# EAGLE design RedFly-Shield_v11 (EAGLE 6.5.0)
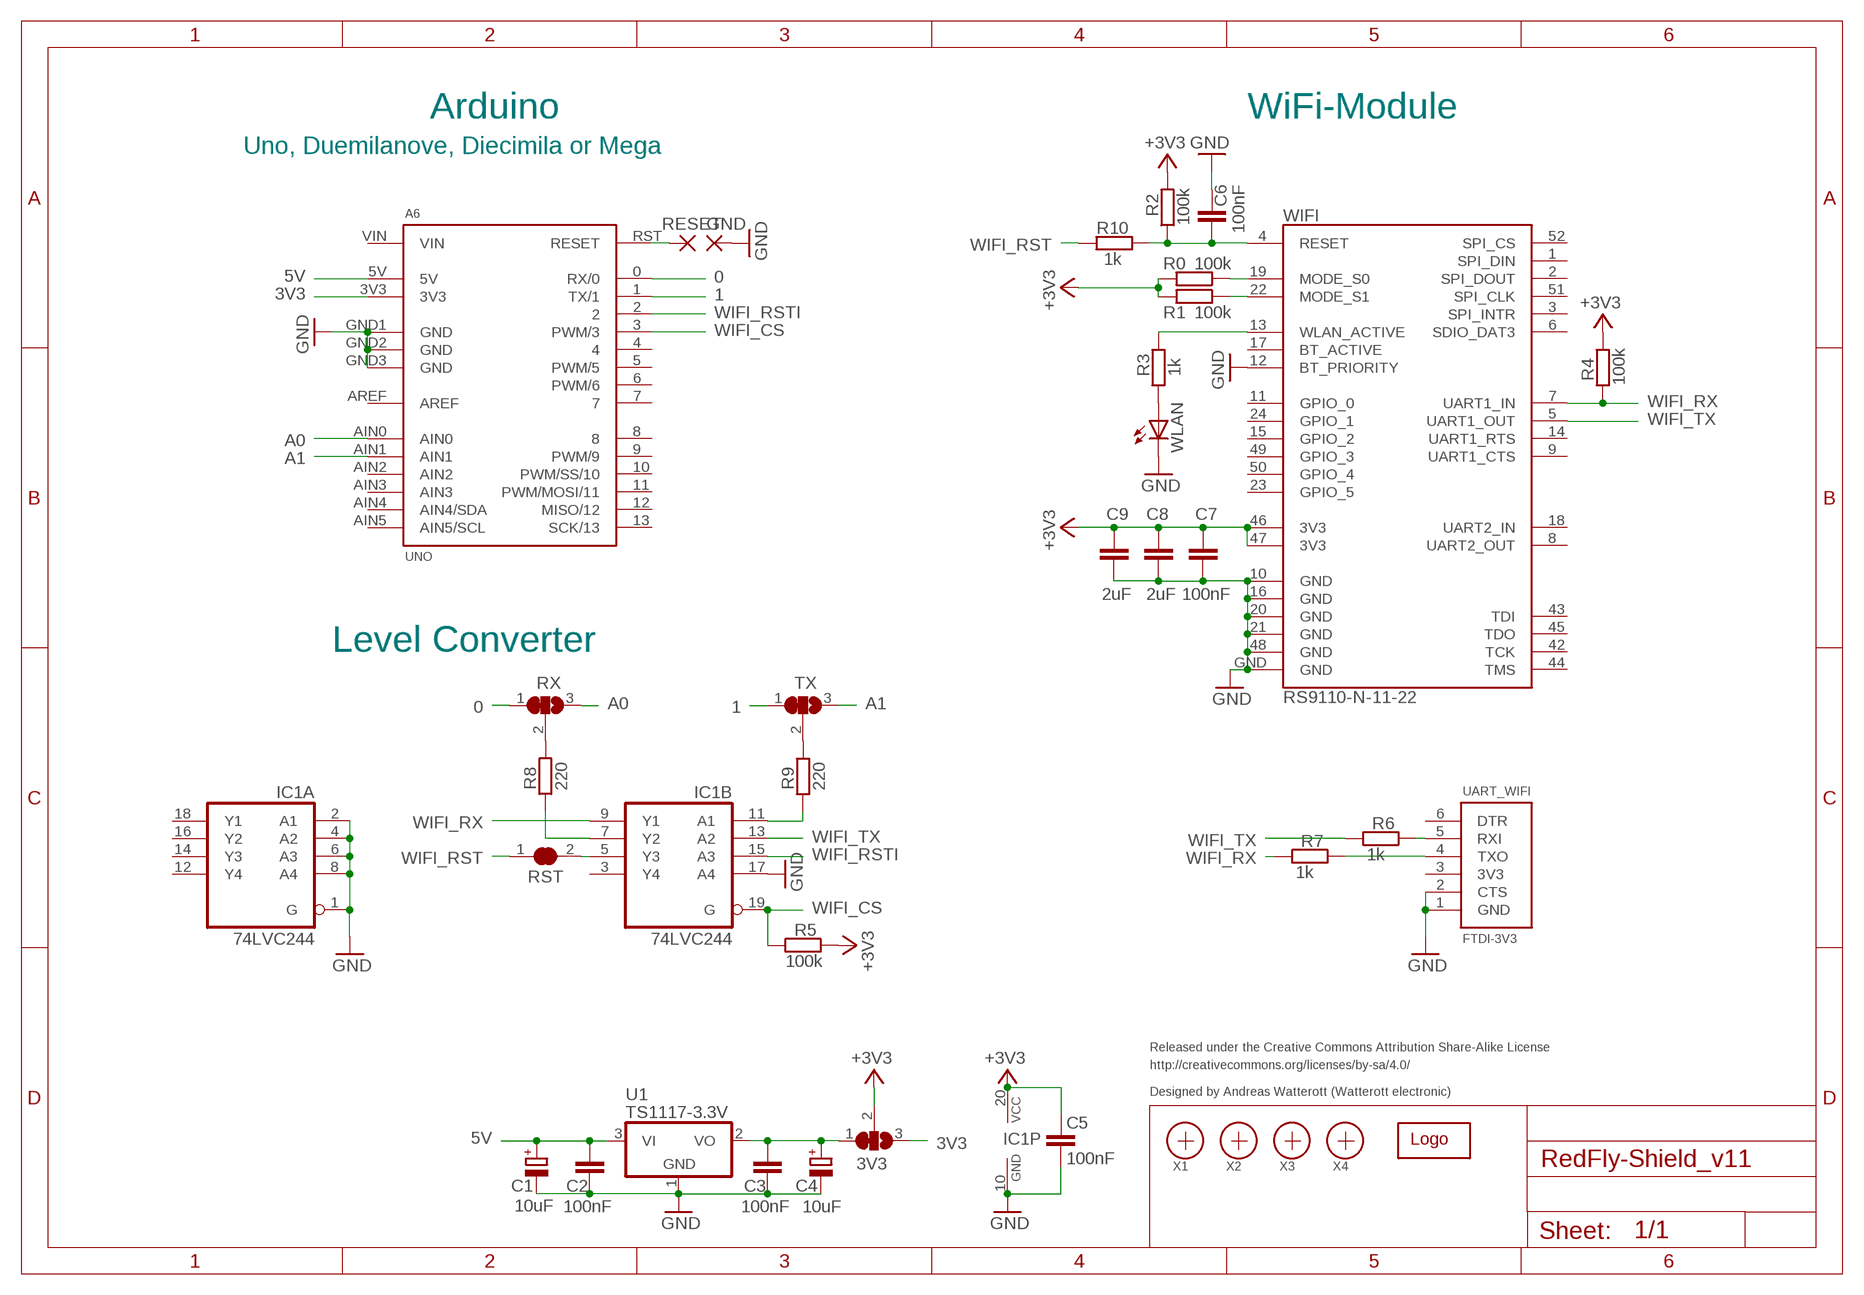
[diagram p0: schematic, sheet 1]

## Parts
3V3  SJ2W  [SJ_2]
A6  UNO  DUEMILANOVE  [DUEMILANOVE]
C1  10uF  CPOL-EU153CLV-0505  [153CLV-0505]
C2  100nF  C-EUC0603  [C0603]
C3  100nF  C-EUC0603  [C0603]
C4  10uF  CPOL-EU153CLV-0505  [153CLV-0505]
C5  100nF  C-EUC0603  [C0603]
C6  100nF  C-EUC0603  [C0603]
C7  100nF  C-EUC0603  [C0603]
C8  2uF  C-EUC0603  [C0603]
C9  2uF  C-EUC0603  [C0603]
GND  SMD2  [SMD1,27-2,54]
IC1  74LVC244  74HC244DW  [SO20W]
R0  100k  R-EU_R0603  [R0603]
R1  100k  R-EU_R0603  [R0603]
R2  100k  R-EU_R0603  [R0603]
R3  1k  R-EU_R0603  [R0603]
R4  100k  R-EU_R0603  [R0603]
R5  100k  R-EU_R0603  [R0603]
R6  1k  R-EU_R0603  [R0603]
R7  1k  R-EU_R0603  [R0603]
R8  220  R-EU_R0603  [R0603]
R9  220  R-EU_R0603  [R0603]
R10  1k  R-EU_R0603  [R0603]
RESET  SMD2  [SMD1,27-2,54]
RST  SJ  [SJ]
RX  SJ2W  [SJ_2]
TX  SJ2W  [SJ_2]
U1  TS1117-3.3V  TS1117  [SOT223]
U$1  WE-LOGO  [WE-LOGO]
UART_WIFI  FTDI-3V3  FTDI  [FTDI]
WIFI  RS9110-N-11-22  RS9110-N-11-21  [RS9110-N-11-21]
WLAN  LEDCHIPLED_0805  [CHIPLED_0805]
X1  PASSER  [PASSER]
X2  PASSER  [PASSER]
X3  PASSER  [PASSER]
X4  PASSER  [PASSER]

## Nets
0: A6.0(RX/0) RX.1
1: A6.1(TX/1) TX.1
3V3: 3V3.3 A6.3V3
3V_OUT: 3V3.1 C3.1 C4.+ U1.2(VO)
5V: A6.5V C1.+ C2.1 U1.3(VI)
+3V3: 3V3.2 C5.1 C7.1 C8.1 C9.1 IC1.20(P:VCC) R0.2 R1.2 R2.2 R4.1 R5.2 WIFI.46(3V3) WIFI.47(3V3)
A0: A6.AIN0 RX.3
A1: A6.AIN1 TX.3
GND: A6.GND1(GND) A6.GND2(GND) A6.GND3(GND) C1.- C2.2 C3.2 C4.- C5.2 C6.1 C7.2 C8.2 C9.2 GND.1(P) IC1.1(A:G) IC1.2(A:A1) IC1.4(A:A2) IC1.6(A:A3) IC1.8(A:A4) IC1.10(P:GND) IC1.17(B:A4) U1.1(GND) UART_WIFI.1(GND) UART_WIFI.2(CTS) WIFI.10(GND) WIFI.12(BT_PRIORITY) WIFI.16(GND) WIFI.20(GND) WIFI.21(GND) WIFI.48(GND) WIFI.GND WLAN.C
N$1: R0.1 WIFI.19(MODE_S0)
N$6: R1.1 WIFI.22(MODE_S1)
N$11: R3.1 WIFI.13(WLAN_ACTIVE)
N$12: R3.2 WLAN.A
N$103: R6.1 UART_WIFI.5(RXI)
N$104: R7.1 UART_WIFI.4(TXO)
RST: A6.RST(RESET) RESET.1(P)
WIFI_CS: A6.3(PWM/3) IC1.19(B:G) R5.1
WIFI_RST: R10.2 RST.1
WIFI_RST2: C6.2 R2.1 R10.1 WIFI.4(RESET)
WIFI_RSTI: A6.2 IC1.15(B:A3)
WIFI_RSTO: IC1.5(B:Y3) RST.2
WIFI_RX: IC1.9(B:Y1) R4.2 R7.2 WIFI.7(UART1_IN)
WIFI_RX2: R9.1 TX.2
WIFI_RXI: IC1.11(B:A1) R9.2
WIFI_TX: IC1.13(B:A2) R6.2 WIFI.5(UART1_OUT)
WIFI_TX2: R8.2 RX.2
WIFI_TXO: IC1.7(B:Y2) R8.1
Unconnected: A6.4 A6.5(PWM/5) A6.6(PWM/6) A6.7 A6.8 A6.9(PWM/9) A6.10(PWM/SS/10) A6.11(PWM/MOSI/11) A6.12(MISO/12) A6.13(SCK/13) A6.AIN2 A6.AIN3 A6.AIN4(AIN4/SDA) A6.AIN5(AIN5/SCL) IC1.3(B:Y4) IC1.12(A:Y4) IC1.14(A:Y3) IC1.16(A:Y2) IC1.18(A:Y1) UART_WIFI.3(3V3) UART_WIFI.6(DTR) WIFI.1(SPI_DIN) WIFI.2(SPI_DOUT) WIFI.3(SPI_INTR) WIFI.6(SDIO_DAT3) WIFI.8(UART2_OUT) WIFI.9(UART1_CTS) WIFI.11(GPIO_0) WIFI.14(UART1_RTS) WIFI.15(GPIO_2) WIFI.17(BT_ACTIVE) WIFI.18(UART2_IN) WIFI.23(GPIO_5) WIFI.24(GPIO_1) WIFI.42(TCK) WIFI.43(TDI) WIFI.44(TMS) WIFI.45(TDO) WIFI.49(GPIO_3) WIFI.50(GPIO_4) WIFI.51(SPI_CLK) WIFI.52(SPI_CS)

## Notes on the sheet
- Arduino | WiFi-Module
- Uno, Duemilanove, Diecimila or Mega
- Level Converter
- Released under the Creative Commons Attribution Share-Alike License
- http://creativecommons.org/licenses/by-sa/4.0/
- Designed by Andreas Watterott (Watterott electronic)

## Power pins joined to a net without a drawn wire
AREF: A6.AREF
VIN: A6.VIN

## Library data of the parts
3V3 RX TX = jumper:SJ2W: SMD solder JUMPER
A6 = Arduino:DUEMILANOVE: Arduino Duemilanove
C1 C4 = rcl:CPOL-EU: POLARIZED CAPACITOR, European symbol
C2 C3 C5-C9 = rcl:C-EU: CAPACITOR, European symbol
GND RESET = wirepad:SMD2: SMD PAD
IC1 = 74xx-eu:74*244: Octal BUFFER and LINE DRIVER, 3-state
R0 R1-R10 = rcl:R-EU_: RESISTOR, European symbol
RST = jumper:SJ: SMD solder JUMPER
U1 = Voltage-Reg:TS1117
U$1 = welectronic:WE-LOGO
UART_WIFI = Arduino:FTDI: 6pol FTDI Connector
WIFI = RedpineSignals:RS9110-N-11-21: Redpine Signals RS9110-N-11-21
WLAN = led:LED: LED OSRAM: - CHIPLED LG R971, LG N971, LY N971, LG Q971, LY Q971, LO R971, LY R971 LH N974, LH R974 LS Q976, LO Q976, LY Q976 LO Q996 - Hyper CHIPLED LW Q18S LB Q993, LB Q99A, LB R99A - SideLED LS A670, LO A670, LY A670, LG A670, LP A670 LB A673, LV A673, LT A673, LW A673 LH A674 LY A675 LS A676, LA A676, LO A676, LY A676, LW A676 LS A679, LY A679, LG A679 - Hyper Micro SIDELED® LS Y876, LA Y876, LO Y876, LY Y876 LT Y87S - SmartLED LW L88C, LW L88S LB L89C, LB L89S, LG L890 LS L89K, LO L89K, LY L89K LS L896, LA L896, LO L896, LY L896 - TOPLED LS T670, LO T670, LY T670, LG T670, LP T670 LSG T670, LSP T670, LSY T670, LOP T670, LYG T670 LG T671, LOG T671, LSG T671 LB T673, LV T673, LT T673, LW T673 LH T674 LS T676, LA T676, LO T676, LY T676, LB T676, LH T676, LSB T676, LW T676 LB T67C, LV T67C, LT T67C, LS T67K, LO T67K, LY T67K, LW E67C LS E67B, LA E67B, LO E67B, LY E67B, LB E67C, LV E67C, LT E67C LW T67C LS T679, LY T679, LG T679 LS T770, LO T770, LY T770, LG T770, LP T770 LB T773, LV T773, LT T773, LW T773 LH T774 LS E675, LA E675, LY E675, LS T675 LS T776, LA T776, LO T776, LY T776, LB T776 LHGB T686 LT T68C, LB T68C - Hyper Mini TOPLED® LB M676 - Mini TOPLED Santana® LG M470 LS M47K, LO M47K, LY M47K Source: http://www.osram.convergy.de LUXEON: - LUMILED® LXK2-PW12-R00, LXK2-PW12-S00, LXK2-PW14-U00, LXK2-PW14-V00 LXK2-PM12-R00, LXK2-PM12-S00, LXK2-PM14-U00 LXK2-PE12-Q00, LXK2-PE12-R00, LXK2-PE12-S00, LXK2-PE14-T00, LXK2-PE14-U00 LXK2-PB12-K00, LXK2-PB12-L00, LXK2-PB12-M00, LXK2-PB14-N00, LXK2-PB14-P00, LXK2-PB14-Q00 LXK2-PR12-L00, LXK2-PR12-M00, LXK2-PR14-Q00, LXK2-PR14-R00 LXK2-PD12-Q00, LXK2-PD12-R00, LXK2-PD12-S00 LXK2-PH12-R00, LXK2-PH12-S00 LXK2-PL12-P00, LXK2-PL12-Q00, LXK2-PL12-R00 Source: www.luxeon.com KINGBRIGHT: KA-3528ASYC Source: www.kingbright.com
X1-X4 = SMD:PASSER

## Board
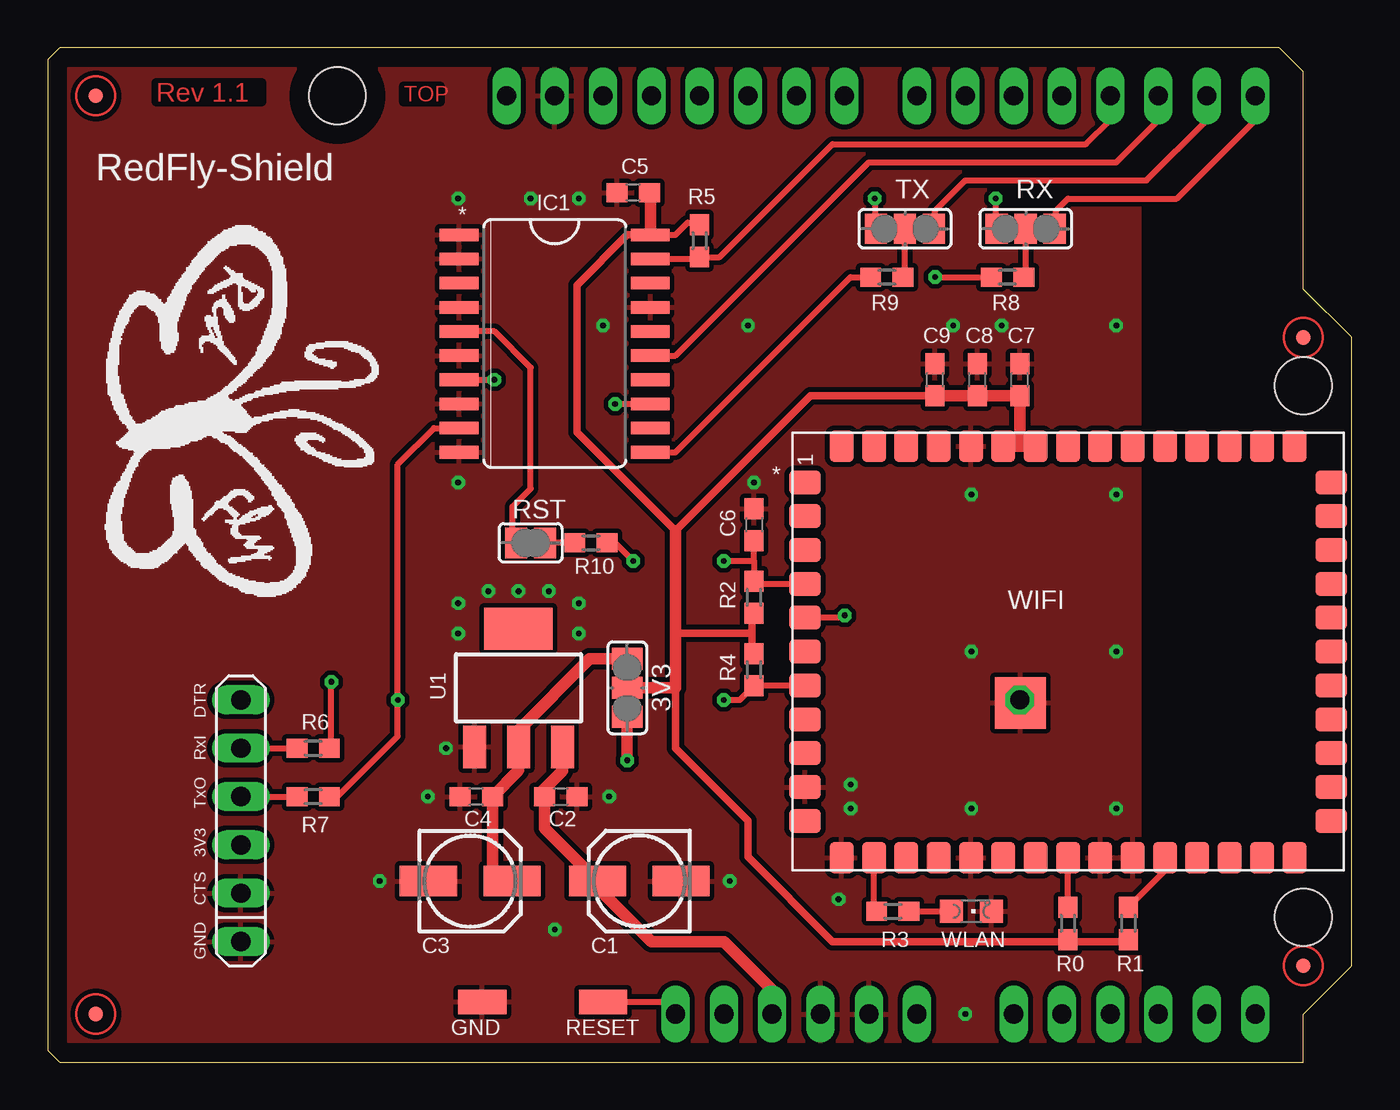
[diagram p1: board, top side]
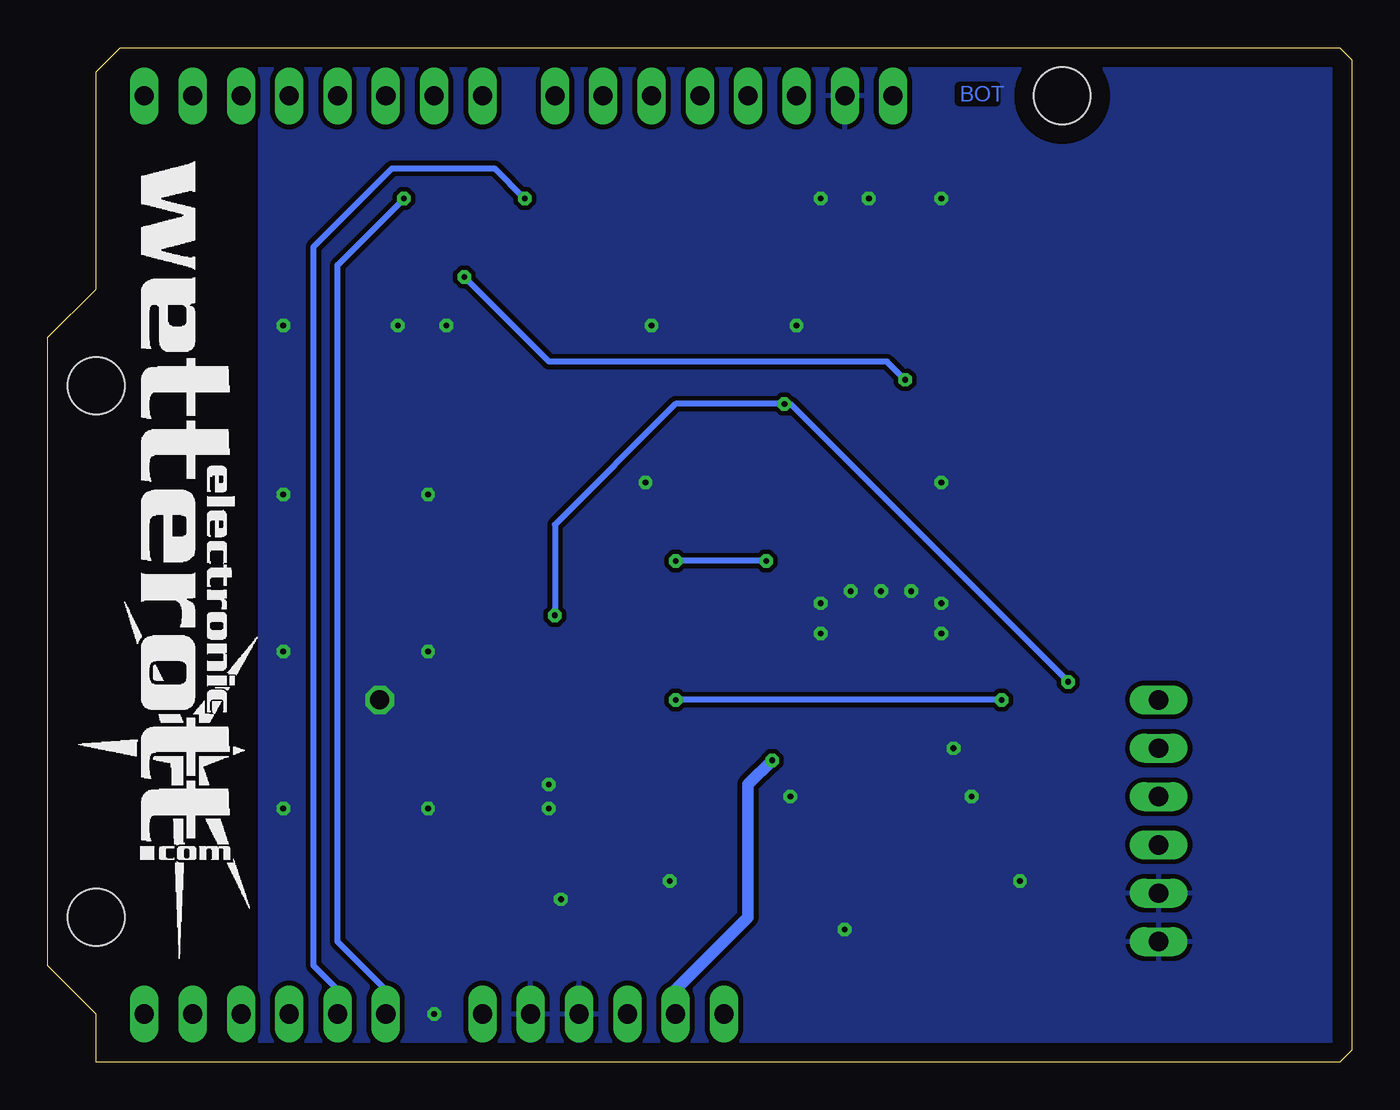
[diagram p2: board, bottom side, seen from below]

Size 68.58 x 53.34 mm. Coordinates in mm from the lower left corner, seen from the top.
Copper layers (1*16): Top 0.035mm / dielectric 1.5mm / Bottom 0.035mm
Design rules "default *": minimum track width 10mil, minimum drill 0.3mm, track to track 8mil, track to pad 8mil, pad to pad 8mil, via to via 8mil, smd to smd 8mil, copper to edge 40mil, drill to drill 8mil, minimum pad ring 10mil, minimum via ring 8mil, stop-mask expansion 4mil, vias tented up to drill 0.5mm, thermal gap 10mil
tRestrict: area 57.8,0 to 68.6,53.3
bRestrict: area 57.8,0 to 68.6,53.3

### Footprints (pad centres in the part's own frame; a part is rotated, then mirrored left to right if it is on the bottom)
SJ_2 = smd 1.168 x 1.6: 1 -1.524,0; 2 0,0; 3 1.524,0
DUEMILANOVE = drill 1 long: 0 63.5,50.8; 1 60.96,50.8; 2 58.42,50.8; 3 55.88,50.8; 3V3 35.56,2.54; 4 53.34,50.8; 5 50.8,50.8; 5V 38.1,2.54; 6 48.26,50.8; 7 45.72,50.8; 8 41.91,50.8; 9 39.37,50.8; 10 36.83,50.8; 11 34.29,50.8; 12 31.75,50.8; 13 29.21,50.8; AIN0 50.8,2.54; AIN1 53.34,2.54; AIN2 55.88,2.54; AIN3 58.42,2.54; AIN4 60.96,2.54; AIN5 63.5,2.54; AREF 24.13,50.8; GND1 40.64,2.54; GND2 43.18,2.54; GND3 26.67,50.8; RST 33.02,2.54; VIN 45.72,2.54 | hole 3: 66.04,35.56; 66.04,7.62; 15.24,50.8
153CLV-0505 = smd 3 x 1.6: + 2.2,0; - -2.2,0
C0603 = smd 1.1 x 1: 1 -0.85,0; 2 0.85,0
SMD1,27-2,54 = smd 1.27 x 2.54: 1 0,0
SO20W = smd 0.66 x 2.032: 1 -5.715,-5.029; 2 -4.445,-5.029; 3 -3.175,-5.029; 4 -1.905,-5.029; 5 -0.635,-5.029; 6 0.635,-5.029; 7 1.905,-5.029; 8 3.175,-5.029; 9 4.445,-5.029; 10 5.715,-5.029; 11 5.715,5.029; 12 4.445,5.029; 13 3.175,5.029; 14 1.905,5.029; 15 0.635,5.029; 16 -0.635,5.029; 17 -1.905,5.029; 18 -3.175,5.029; 19 -4.445,5.029; 20 -5.715,5.029
R0603 = smd 1.1 x 1: 1 -0.85,0; 2 0.85,0
SJ = smd 1.168 x 1.6: 1 -0.762,0; 2 0.762,0
SOT223 = smd 1.219 x 2.235: 1 -2.311,-3.099; 2 0,-3.099; 3 2.311,-3.099 | smd 3.6 x 2.2: 4 0,3.099
FTDI = drill 1.016 long: 1 -6.35,0; 2 -3.81,0; 3 -1.27,0; 4 1.27,0; 5 3.81,0; 6 6.35,0
RS9110-N-11-21 = smd 1.27 x 1.676: 1 -8.9,-13.832; 2 -7.12,-13.832; 3 -5.34,-13.832; 4 -3.56,-13.832; 5 -1.78,-13.832; 6 0,-13.832; 7 1.78,-13.832; 8 3.56,-13.832; 9 5.34,-13.832; 10 7.12,-13.832; 11 8.9,-13.832; 27 8.9,13.84; 28 7.12,13.84; 29 5.34,13.84; 30 3.56,13.84; 31 1.78,13.84; 32 0,13.84; 33 -1.78,13.84; 34 -3.56,13.84; 35 -5.34,13.84; 36 -7.12,13.84; 37 -8.9,13.84 | smd 1.676 x 1.27: 12 10.83,-11.9; 13 10.83,-10.2; 14 10.83,-8.5; 15 10.83,-6.8; 16 10.83,-5.1; 17 10.83,-3.4; 18 10.83,-1.7; 19 10.83,0; 20 10.83,1.7; 21 10.83,3.4; 22 10.83,5.1; 23 10.83,6.8; 24 10.83,8.5; 25 10.83,10.2; 26 10.83,11.9; 38 -10.8,11.9; 39 -10.8,10.2; 40 -10.8,8.5; 41 -10.8,6.8; 42 -10.8,5.1; 43 -10.8,3.4; 44 -10.8,1.7; 45 -10.8,0; 46 -10.8,-1.7; 47 -10.8,-3.4; 48 -10.8,-5.1; 49 -10.8,-6.8; 50 -10.8,-8.5; 51 -10.8,-10.2; 52 -10.8,-11.9 | smd 2.7 x 2.7: GND 2.7,-2.5
CHIPLED_0805 = smd 1.2 x 1.2: A 0,-1.05; C 0,1.05
PASSER = smd 0.762 x 0.762: X 0,0

### Placement (x,y rotation side)
3V3  30.48,19.68 270 top
A6  0,0 0 top
C1  31.11,9.53 180 top
C2  26.99,13.97 0 top
C3  22.54,13.97 180 top
C4  22.23,9.53 0 top
C5  30.8,45.72 180 top
C6  37.15,28.26 270 top
C7  51.12,35.88 90 top
C8  48.9,35.88 90 top
C9  46.67,35.88 90 top
GND  22.86,3.17 90 top
IC1  26.67,37.78 270 top
R0  53.66,7.3 270 top
R1  56.83,7.3 270 top
R2  37.15,24.45 270 top
R3  44.45,7.94 0 top
R4  37.15,20.64 270 top
R5  34.29,43.18 90 top
R6  13.97,16.51 0 top
R7  13.97,13.97 0 top
R8  50.48,41.27 0 top
R9  44.13,41.27 180 top
R10  28.57,27.3 180 top
RESET  29.21,3.17 90 top
RST  25.4,27.3 180 top
RX  51.44,43.81 180 top
TX  45.09,43.81 180 top
U1  24.77,19.68 0 top
U$1  67.31,47.62 270 bottom
UART_WIFI  10.16,12.7 90 top
WIFI  53.66,21.59 270 top
WLAN  48.58,7.94 270 top
X1  2.54,2.54 0 top
X2  2.54,50.8 0 top
X3  66.04,38.1 0 top
X4  66.04,5.08 0 top

### Tracks (layer width: path | path; a pad name or v marks a point on that pad's centre or on a via)
0
  Top 0.305: A6.0 63.5,49.53 59.37,45.4 53.66,45.4 53.02,44.77 53.02,43.88 RX.1
1
  Top 0.305: A6.1 60.96,49.53 57.78,46.35 48.26,46.35 46.67,44.77 46.67,43.88 TX.1
3V3  (via drill 0.3)
  Top 0.61: v30.48,15.88 3V3.3
  Bottom 0.61: v30.48,15.88 31.75,14.61 31.75,7.62 35.56,3.81 A6.3V3
3V_OUT
  Top 0.61: C4.+ 23.81,9.53 23.39,9.95 C3.1 24.77,15.34 U1.2 24.77,17.46 28.51,21.21 3V3.1
5V
  Top 0.305: 29.06,9.38 29.21,9.23 | 26.04,14.07 26.04,14.29
  Top 0.61: A6.5V 38.1,3.81 35.56,6.35 31.75,6.35 29.21,8.89 29.21,9.23 | 29.06,9.38 C1.+ 26.14,12.3 C2.1 26.04,14.07 | U1.3 27.08,15.33 26.04,14.29
+3V3
  Top 0.305: 51.12,32.38 51.12,32.39 | IC1.20 33.02,43.5 33.66,44.13 34.19,44.13 R5.2 | 53.66,6.35 R0.2 | 56.73,6.35 R1.2 | 37.05,23.5 R2.2 | 37.05,21.59 R4.1 | 31.7,45.67 C5.1
  Top 0.406: 33.02,19.68 33.02,16.51 36.83,12.7 36.83,10.79 41.27,6.35 53.66,6.35 56.73,6.35 | C9.1 40.11,35.03 33.02,27.94 27.84,33.12 27.84,40.85 30.48,43.5 IC1.20 | 37.05,22.54 37.05,21.59 | 37.05,22.54 37.05,23.5 | 33.02,22.54 37.05,22.54
  Top 0.61: WIFI.47 WIFI.46 51.12,32.39 | 51.12,32.38 C7.1 C8.1 C9.1 | 3V3.2 33.02,19.68 33.02,22.54 33.02,27.94 | IC1.20 31.7,45.67
A0  (via drill 0.3)
  Top 0.305: v49.85,45.4 49.85,43.88 RX.3
  Bottom 0.305: A6.AIN0 50.8,3.81 53.34,6.35 53.34,41.91 v49.85,45.4
A1  (via drill 0.3)
  Top 0.305: v43.5,45.4 43.5,43.88 TX.3
  Bottom 0.305: A6.AIN1 53.34,3.81 54.61,5.08 54.61,42.86 50.48,46.99 45.09,46.99 v43.5,45.4
GND  (via drill 0.3, 1)
  other vias: 48.26,2.54 48.58,29.84 42.23,13.34 48.58,13.34 56.2,13.34 51.12,19.05 47.62,38.73 42.23,14.61 20,13.97 29.53,13.97 37.15,30.48 21.59,22.54 27.94,22.54 23.18,24.77 26.35,24.77 24.77,24.77 21.59,24.13 27.94,24.13 50.16,38.73 17.46,9.53 35.88,9.53 20.95,16.51 41.59,8.57 27.94,45.4 21.59,30.48 29.21,38.73 25.4,45.4 36.83,38.73 21.59,45.4 56.2,29.84 56.2,38.73 48.58,21.59 56.2,21.59 26.67,6.99
  pour Bottom (isolate 0.254): 0,53.34 68.58,53.34 68.58,0 0,0
  pour Top (isolate 0.254): 0,0 0,53.34 68.58,53.34 68.58,0
N$1
  Top 0.305: R0.1 WIFI.19
N$2
  Top 0.406: 24.77,27.3 26.04,27.3
N$3
  Top 0.406: 45.09,43.81 46.67,43.81
N$4
  Top 0.406: 53.02,43.81 51.44,43.81
N$6
  Top 0.305: WIFI.22 58.76,10.08 R1.1
N$11
  Top 0.305: WIFI.13 43.46,8.08 R3.1
N$12
  Top 0.305: R3.2 WLAN.A
N$31
  Top 0.406: 30.48,19.68 30.48,21.27
N$103
  Top 0.305: UART_WIFI.5 R6.1
N$104
  Top 0.305: UART_WIFI.4 R7.1
RST
  Top 0.305: A6.RST 32.38,3.17 RESET.1
WIFI_CS
  Top 0.305: A6.3 55.88,49.53 54.61,48.26 41.27,48.26 35.34,42.33 R5.1 34.29,42.23 IC1.19
WIFI_RST
  Top 0.305: R10.2 RST.1
WIFI_RST2  (via drill 0.3)
  Top 0.305: WIFI.4 37.3,25.15 R2.1 37.15,26.35 | 37.15,26.35 C6.2 | R10.1 29.84,27.3 v30.8,26.35 | v35.56,26.35 37.15,26.35
  Bottom 0.305: v30.8,26.35 v35.56,26.35
WIFI_RSTI
  Top 0.305: A6.2 58.42,49.53 56.2,47.31 43.18,47.31 33.02,37.15 IC1.15
WIFI_RSTO
  Top 0.305: IC1.5 23.5,38.42 25.4,36.51 25.4,30.16 24.45,29.21 24.45,27.5 RST.2
WIFI_RX  (via drill 0.3)
  Top 0.305: WIFI.7 37.17,19.81 R4.2 36.41,19.05 v35.56,19.05 | R7.2 15.24,13.97 18.41,17.14 v18.41,19.05 18.41,31.43 20.32,33.34 IC1.9
  Bottom 0.305: v18.41,19.05 v35.56,19.05
WIFI_RX2
  Top 0.305: TX.2 45.09,41.38 R9.1
WIFI_RXI
  Top 0.305: IC1.11 33.02,32.07 42.23,41.27 R9.2
WIFI_TX  (via drill 0.3)
  Top 0.305: v29.84,34.61 IC1.13 | v14.92,20 14.92,16.61 R6.2 | WIFI.5 41.78,23.37 v41.91,23.5
  Bottom 0.305: v14.92,20 29.53,34.61 v29.84,34.61 35.56,34.61 41.91,28.26 v41.91,23.5
WIFI_TX2
  Top 0.305: RX.2 51.44,41.38 R8.2
WIFI_TXO  (via drill 0.3)
  Top 0.305: IC1.7 v23.5,35.88 | v46.67,41.27 R8.1
  Bottom 0.305: v23.5,35.88 24.45,36.83 42.23,36.83 v46.67,41.27

### Text on the board
Top: Rev 1.1 | TOP
Bottom: BOT
tPlace: * | *
tNames: RedFly-Shield